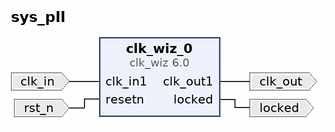
[diagram p0: block diagram of the top level]
# Vivado block design sys_pll, xc7a35ticsg324-1L, Vivado 2018.1_AR71169_AR71147
create_bd_design sys_pll

create_bd_port -dir I -type clk clk_in
set_property -dict {CONFIG.FREQ_HZ 100000000} [get_bd_ports clk_in]
create_bd_port -dir I -type rst rst_n
create_bd_port -dir O -type clk clk_out
create_bd_port -dir O -type data locked

create_bd_cell -type ip -vlnv xilinx.com:ip:clk_wiz:6.0 clk_wiz_0
set_property -dict [list \
  CONFIG.PRIMITIVE PLL \
  CONFIG.CLKOUT1_REQUESTED_OUT_FREQ 25.000 \
  CONFIG.CLKOUT1_DRIVES BUFG \
  CONFIG.CLKOUT2_DRIVES BUFG \
  CONFIG.CLKOUT3_DRIVES BUFG \
  CONFIG.CLKOUT4_DRIVES BUFG \
  CONFIG.CLKOUT5_DRIVES BUFG \
  CONFIG.CLKOUT6_DRIVES BUFG \
  CONFIG.CLKOUT7_DRIVES BUFG \
  CONFIG.RESET_PORT resetn \
  CONFIG.MMCM_DIVCLK_DIVIDE 4 \
  CONFIG.MMCM_CLKFBOUT_MULT_F 33 \
  CONFIG.MMCM_CLKIN1_PERIOD 10.000 \
  CONFIG.MMCM_CLKIN2_PERIOD 10.000 \
  CONFIG.MMCM_COMPENSATION ZHOLD \
  CONFIG.MMCM_CLKOUT0_DIVIDE_F 33 \
  CONFIG.RESET_TYPE ACTIVE_LOW \
  CONFIG.CLKOUT1_JITTER 352.369 \
  CONFIG.CLKOUT1_PHASE_ERROR 261.747 \
] [get_bd_cells clk_wiz_0]

# ---- connections ----

connect_bd_net [get_bd_ports clk_in] [get_bd_pins clk_wiz_0/clk_in1]
connect_bd_net [get_bd_ports rst_n] [get_bd_pins clk_wiz_0/resetn]
connect_bd_net [get_bd_pins clk_wiz_0/clk_out1] [get_bd_ports clk_out]
connect_bd_net [get_bd_pins clk_wiz_0/locked] [get_bd_ports locked]

validate_bd_design
save_bd_design
